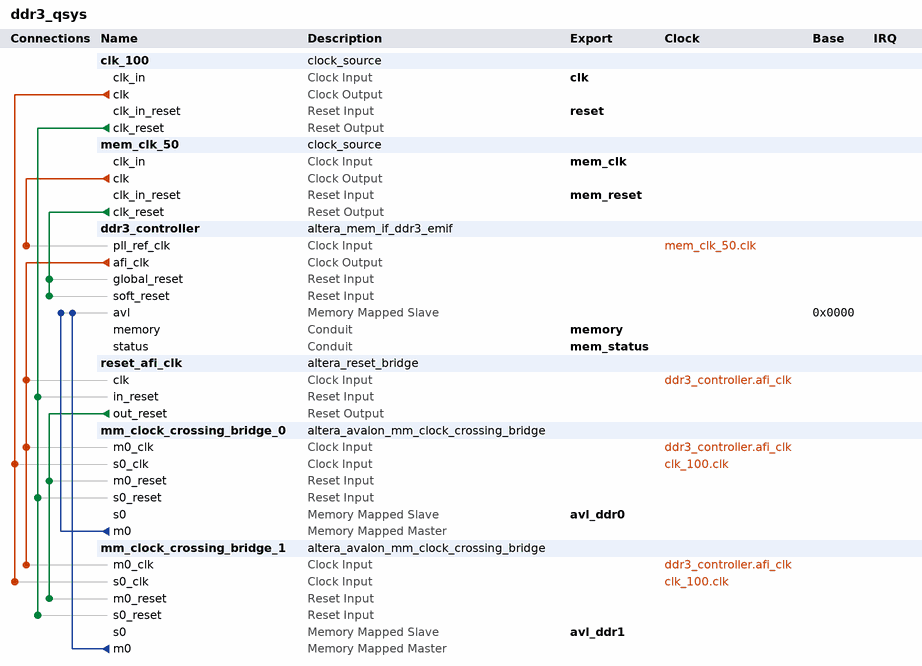
[diagram p0: system contents]
# Platform Designer (Qsys) system ddr3_qsys, MAX 10 10M50DAF484C6GES
# Parameters at their usual value, and those the tool derives, are not listed.
package require -exact qsys 17.1
create_system ddr3_qsys
set_project_property DEVICE_FAMILY {MAX 10}
set_project_property DEVICE 10M50DAF484C6GES

add_instance clk_100 clock_source 17.1
set_instance_parameter_value clk_100 clockFrequency 100000000
set_instance_parameter_value clk_100 resetSynchronousEdges DEASSERT

add_instance mem_clk_50 clock_source 17.1
set_instance_parameter_value mem_clk_50 clockFrequency 125000000
set_instance_parameter_value mem_clk_50 resetSynchronousEdges DEASSERT

add_instance ddr3_controller altera_mem_if_ddr3_emif 17.1
set_instance_parameter_value ddr3_controller AVL_MAX_SIZE 4
set_instance_parameter_value ddr3_controller CALIBRATION_MODE Skip
set_instance_parameter_value ddr3_controller CPORT_TYPE_PORT Bidirectional,Bidirectional,Bidirectional,Bidirectional,Bidirectional,Bidirectional
set_instance_parameter_value ddr3_controller EXPORT_AFI_HALF_CLK false
set_instance_parameter_value ddr3_controller HARD_EMIF false
set_instance_parameter_value ddr3_controller MEM_BANKADDR_WIDTH 3
set_instance_parameter_value ddr3_controller MEM_CLK_FREQ 300.0
set_instance_parameter_value ddr3_controller MEM_CLK_FREQ_MAX 800.0
set_instance_parameter_value ddr3_controller MEM_COL_ADDR_WIDTH 10
set_instance_parameter_value ddr3_controller MEM_DQ_WIDTH 16
set_instance_parameter_value ddr3_controller MEM_FORMAT DISCRETE
set_instance_parameter_value ddr3_controller MEM_ROW_ADDR_WIDTH 15
set_instance_parameter_value ddr3_controller MEM_TCL 7
set_instance_parameter_value ddr3_controller MEM_TFAW_NS 45.0
set_instance_parameter_value ddr3_controller MEM_TRAS_NS 35.0
set_instance_parameter_value ddr3_controller MEM_TRCD_NS 13.75
set_instance_parameter_value ddr3_controller MEM_TRFC_NS 260.0
set_instance_parameter_value ddr3_controller MEM_TRP_NS 13.75
set_instance_parameter_value ddr3_controller MEM_TRRD_NS 7.5
set_instance_parameter_value ddr3_controller MEM_TRTP_NS 7.5
set_instance_parameter_value ddr3_controller MEM_TWTR 6
set_instance_parameter_value ddr3_controller MEM_VENDOR Micron
set_instance_parameter_value ddr3_controller MEM_WTCL 6
set_instance_parameter_value ddr3_controller PLL_LOCATION Top_Bottom
set_instance_parameter_value ddr3_controller POWER_OF_TWO_BUS true
set_instance_parameter_value ddr3_controller PRIORITY_PORT 1,1,1,1,1,1
set_instance_parameter_value ddr3_controller RATE Half
set_instance_parameter_value ddr3_controller REF_CLK_FREQ 50.0
set_instance_parameter_value ddr3_controller SPEED_GRADE 6
set_instance_parameter_value ddr3_controller TIMING_BOARD_AC_SKEW 0.017
set_instance_parameter_value ddr3_controller TIMING_BOARD_AC_TO_CK_SKEW -1.3E-4
set_instance_parameter_value ddr3_controller TIMING_BOARD_DQ_TO_DQS_SKEW -6.0E-4
set_instance_parameter_value ddr3_controller TIMING_BOARD_MAX_CK_DELAY 0.183
set_instance_parameter_value ddr3_controller TIMING_BOARD_MAX_DQS_DELAY 0.181
set_instance_parameter_value ddr3_controller TIMING_BOARD_SKEW_BETWEEN_DQS 0.005
set_instance_parameter_value ddr3_controller TIMING_BOARD_SKEW_CKDQS_DIMM_MAX 0.007
set_instance_parameter_value ddr3_controller TIMING_BOARD_SKEW_CKDQS_DIMM_MIN 0.002
set_instance_parameter_value ddr3_controller TIMING_BOARD_SKEW_WITHIN_DQS 0.008
set_instance_parameter_value ddr3_controller TIMING_TDH 55
set_instance_parameter_value ddr3_controller TIMING_TDQSCK 225
set_instance_parameter_value ddr3_controller TIMING_TDQSQ 125
set_instance_parameter_value ddr3_controller TIMING_TDQSS 0.25
set_instance_parameter_value ddr3_controller TIMING_TDS 55
set_instance_parameter_value ddr3_controller TIMING_TDSH 0.2
set_instance_parameter_value ddr3_controller TIMING_TDSS 0.2
set_instance_parameter_value ddr3_controller TIMING_TIH 130
set_instance_parameter_value ddr3_controller TIMING_TIS 185
set_instance_parameter_value ddr3_controller TIMING_TQSH 0.4
set_instance_parameter_value ddr3_controller USER_DEBUG_LEVEL 1

add_instance reset_afi_clk altera_reset_bridge 17.1
set_instance_parameter_value reset_afi_clk ACTIVE_LOW_RESET 1
set_instance_parameter_value reset_afi_clk SYNCHRONOUS_EDGES deassert

add_instance mm_clock_crossing_bridge_0 altera_avalon_mm_clock_crossing_bridge 17.1
set_instance_parameter_value mm_clock_crossing_bridge_0 ADDRESS_WIDTH 29
set_instance_parameter_value mm_clock_crossing_bridge_0 COMMAND_FIFO_DEPTH 4
set_instance_parameter_value mm_clock_crossing_bridge_0 DATA_WIDTH 64
set_instance_parameter_value mm_clock_crossing_bridge_0 MASTER_SYNC_DEPTH 2
set_instance_parameter_value mm_clock_crossing_bridge_0 MAX_BURST_SIZE 16
set_instance_parameter_value mm_clock_crossing_bridge_0 RESPONSE_FIFO_DEPTH 32
set_instance_parameter_value mm_clock_crossing_bridge_0 SLAVE_SYNC_DEPTH 2
set_instance_parameter_value mm_clock_crossing_bridge_0 USE_AUTO_ADDRESS_WIDTH 1

add_instance mm_clock_crossing_bridge_1 altera_avalon_mm_clock_crossing_bridge 17.1
set_instance_parameter_value mm_clock_crossing_bridge_1 ADDRESS_WIDTH 29
set_instance_parameter_value mm_clock_crossing_bridge_1 COMMAND_FIFO_DEPTH 4
set_instance_parameter_value mm_clock_crossing_bridge_1 DATA_WIDTH 64
set_instance_parameter_value mm_clock_crossing_bridge_1 MASTER_SYNC_DEPTH 2
set_instance_parameter_value mm_clock_crossing_bridge_1 MAX_BURST_SIZE 16
set_instance_parameter_value mm_clock_crossing_bridge_1 RESPONSE_FIFO_DEPTH 32
set_instance_parameter_value mm_clock_crossing_bridge_1 SLAVE_SYNC_DEPTH 2
set_instance_parameter_value mm_clock_crossing_bridge_1 USE_AUTO_ADDRESS_WIDTH 1

# connections
add_connection clk_100.clk mm_clock_crossing_bridge_0.s0_clk clock
add_connection clk_100.clk mm_clock_crossing_bridge_1.s0_clk clock
add_connection ddr3_controller.afi_clk mm_clock_crossing_bridge_0.m0_clk clock
add_connection ddr3_controller.afi_clk mm_clock_crossing_bridge_1.m0_clk clock
add_connection ddr3_controller.afi_clk reset_afi_clk.clk clock
add_connection mem_clk_50.clk ddr3_controller.pll_ref_clk clock
add_connection clk_100.clk_reset mm_clock_crossing_bridge_0.s0_reset reset
add_connection clk_100.clk_reset mm_clock_crossing_bridge_1.s0_reset reset
add_connection clk_100.clk_reset reset_afi_clk.in_reset reset
add_connection mem_clk_50.clk_reset ddr3_controller.global_reset reset
add_connection mem_clk_50.clk_reset ddr3_controller.soft_reset reset
add_connection reset_afi_clk.out_reset mm_clock_crossing_bridge_0.m0_reset reset
add_connection reset_afi_clk.out_reset mm_clock_crossing_bridge_1.m0_reset reset
add_connection mm_clock_crossing_bridge_0.m0 ddr3_controller.avl avalon
set_connection_parameter_value mm_clock_crossing_bridge_0.m0/ddr3_controller.avl baseAddress 0x0000
add_connection mm_clock_crossing_bridge_1.m0 ddr3_controller.avl avalon
set_connection_parameter_value mm_clock_crossing_bridge_1.m0/ddr3_controller.avl baseAddress 0x0000

# exported interfaces
add_interface avl_ddr0 avalon slave
set_interface_property avl_ddr0 EXPORT_OF mm_clock_crossing_bridge_0.s0
add_interface avl_ddr1 avalon slave
set_interface_property avl_ddr1 EXPORT_OF mm_clock_crossing_bridge_1.s0
add_interface clk clock sink
set_interface_property clk EXPORT_OF clk_100.clk_in
add_interface mem_clk clock sink
set_interface_property mem_clk EXPORT_OF mem_clk_50.clk_in
add_interface mem_reset reset sink
set_interface_property mem_reset EXPORT_OF mem_clk_50.clk_in_reset
add_interface mem_status conduit end
set_interface_property mem_status EXPORT_OF ddr3_controller.status
add_interface memory conduit end
set_interface_property memory EXPORT_OF ddr3_controller.memory
add_interface reset reset sink
set_interface_property reset EXPORT_OF clk_100.clk_in_reset

set_interconnect_requirement {$system} qsys_mm.clockCrossingAdapter FIFO
set_interconnect_requirement {$system} qsys_mm.enableEccProtection FALSE
set_interconnect_requirement {$system} qsys_mm.insertDefaultSlave FALSE
set_interconnect_requirement {$system} qsys_mm.maxAdditionalLatency 4

save_system ddr3_qsys.qsys
